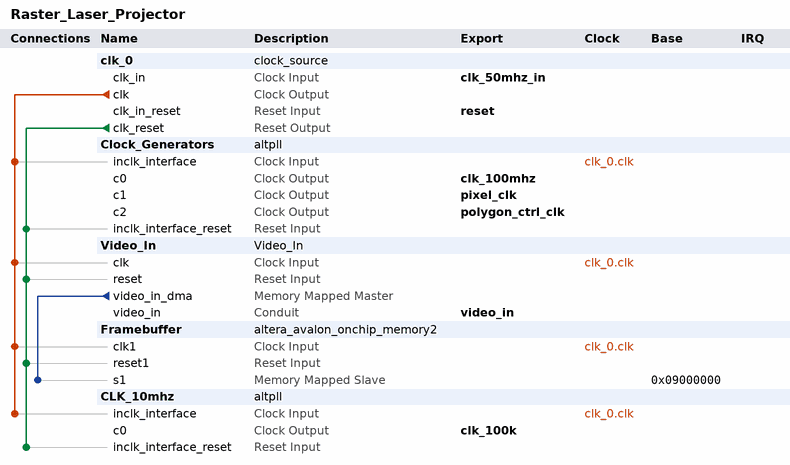
[diagram p0: system contents]
# Platform Designer (Qsys) system Raster_Laser_Projector, Cyclone IV E EP4CE115F29C8
# Parameters at their usual value, and those the tool derives, are not listed.
package require -exact qsys 16.1
create_system Raster_Laser_Projector
set_project_property DEVICE_FAMILY {Cyclone IV E}
set_project_property DEVICE EP4CE115F29C8

add_instance clk_0 clock_source 16.1
set_instance_parameter_value clk_0 clockFrequency 50000000
set_instance_parameter_value clk_0 clockFrequencyKnown false

add_instance Clock_Generators altpll 16.1
set_instance_parameter_value Clock_Generators CLK0_DIVIDE_BY 1
set_instance_parameter_value Clock_Generators CLK0_MULTIPLY_BY 2
set_instance_parameter_value Clock_Generators CLK1_DIVIDE_BY 3125
set_instance_parameter_value Clock_Generators CLK1_DUTY_CYCLE 50
set_instance_parameter_value Clock_Generators CLK1_MULTIPLY_BY 72
set_instance_parameter_value Clock_Generators CLK1_PHASE_SHIFT 0
set_instance_parameter_value Clock_Generators CLK2_DIVIDE_BY 25000
set_instance_parameter_value Clock_Generators CLK2_DUTY_CYCLE 5
set_instance_parameter_value Clock_Generators CLK2_MULTIPLY_BY 1
set_instance_parameter_value Clock_Generators CLK2_PHASE_SHIFT 0
set_instance_parameter_value Clock_Generators INCLK0_INPUT_FREQUENCY 20000
set_instance_parameter_value Clock_Generators PORT_ARESET PORT_USED
set_instance_parameter_value Clock_Generators PORT_LOCKED PORT_USED
set_instance_parameter_value Clock_Generators PORT_clk1 PORT_USED
set_instance_parameter_value Clock_Generators PORT_clk2 PORT_USED
set_instance_parameter_value Clock_Generators PORT_clk3 PORT_UNUSED

add_instance Video_In Video_In 1.0

add_instance Framebuffer altera_avalon_onchip_memory2 16.1
set_instance_parameter_value Framebuffer blockType M9K
set_instance_parameter_value Framebuffer dataWidth 8
set_instance_parameter_value Framebuffer dualPort true
set_instance_parameter_value Framebuffer initMemContent false
set_instance_parameter_value Framebuffer initializationFileName onchip_mem.hex
set_instance_parameter_value Framebuffer memorySize 307200
set_instance_parameter_value Framebuffer resetrequest_enabled false
set_instance_parameter_value Framebuffer singleClockOperation true

add_instance CLK_10mhz altpll 16.1
set_instance_parameter_value CLK_10mhz CLK0_DIVIDE_BY 500
set_instance_parameter_value CLK_10mhz CLK0_MULTIPLY_BY 1
set_instance_parameter_value CLK_10mhz INCLK0_INPUT_FREQUENCY 20000
set_instance_parameter_value CLK_10mhz PORT_ARESET PORT_UNUSED
set_instance_parameter_value CLK_10mhz PORT_LOCKED PORT_UNUSED
set_instance_parameter_value CLK_10mhz PORT_clk1 PORT_UNUSED
set_instance_parameter_value CLK_10mhz PORT_clk2 PORT_UNUSED
set_instance_parameter_value CLK_10mhz PORT_clk3 PORT_UNUSED

# connections
add_connection clk_0.clk CLK_10mhz.inclk_interface clock
add_connection clk_0.clk Clock_Generators.inclk_interface clock
add_connection clk_0.clk Framebuffer.clk1 clock
add_connection clk_0.clk Video_In.clk clock
add_connection clk_0.clk_reset CLK_10mhz.inclk_interface_reset reset
add_connection clk_0.clk_reset Clock_Generators.inclk_interface_reset reset
add_connection clk_0.clk_reset Framebuffer.reset1 reset
add_connection clk_0.clk_reset Video_In.reset reset
add_connection Video_In.video_in_dma Framebuffer.s1 avalon
set_connection_parameter_value Video_In.video_in_dma/Framebuffer.s1 baseAddress 0x09000000

# exported interfaces
add_interface clk_100k clock source
set_interface_property clk_100k EXPORT_OF CLK_10mhz.c0
add_interface clk_100mhz clock source
set_interface_property clk_100mhz EXPORT_OF Clock_Generators.c0
add_interface clk_50mhz_in clock sink
set_interface_property clk_50mhz_in EXPORT_OF clk_0.clk_in
add_interface pixel_clk clock source
set_interface_property pixel_clk EXPORT_OF Clock_Generators.c1
add_interface polygon_ctrl_clk clock source
set_interface_property polygon_ctrl_clk EXPORT_OF Clock_Generators.c2
add_interface reset reset sink
set_interface_property reset EXPORT_OF clk_0.clk_in_reset
add_interface video_in conduit end
set_interface_property video_in EXPORT_OF Video_In.video_in

set_interconnect_requirement {$system} qsys_mm.clockCrossingAdapter HANDSHAKE
set_interconnect_requirement {$system} qsys_mm.enableEccProtection FALSE
set_interconnect_requirement {$system} qsys_mm.insertDefaultSlave FALSE
set_interconnect_requirement {$system} qsys_mm.maxAdditionalLatency 1

save_system Raster_Laser_Projector.qsys
